# EAGLE design lmzmv0 (EAGLE 9.6.2)
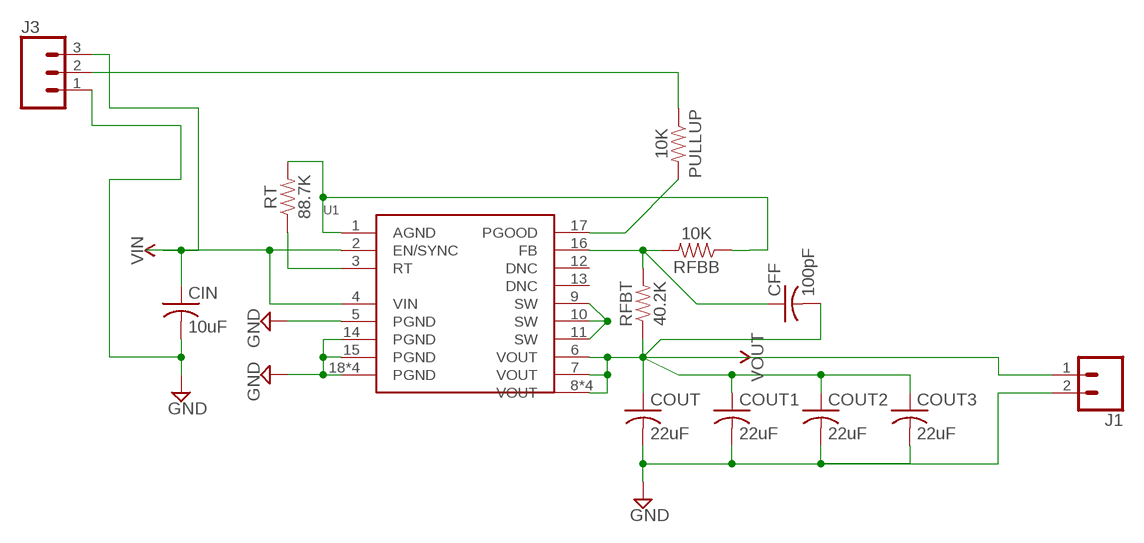
[diagram p0: schematic, sheet 1]

## Parts
CFF  100pF  C-USC0603  [C0603]
CIN  10uF  C-USC0603  [C0603]
COUT  22uF  C-USC0603  [C0603]
COUT1  22uF  C-USC0603  [C0603]
COUT2  22uF  C-USC0603  [C0603]
COUT3  22uF  C-USC0603  [C0603]
J1  CONN_02  [1X02]
J3  CONN_031X03_NO_SILK  [1X03_NO_SILK]
PULLUP  10K  RESISTOR0603  [0603]
RFBB  10K  RESISTOR0603  [0603]
RFBT  40.2K  RESISTOR0603  [0603]
RT  88.7K  RESISTOR0603  [0603]
U1  LMZM_MODULEQFN18TI  [QFN-18]

## Nets
AGND: RFBB.1 RT.2 U1.1(AGND)
FB: CFF.1 RFBB.2 RFBT.2 U1.16(FB)
GND: CIN.2 COUT1.2 COUT2.2 COUT3.2 COUT.2 J1.2 J3.1 U1.5(PGND) U1.14(PGND) U1.15(PGND) U1.18(PGND) U1.W1(PGND) U1.W2(PGND) U1.W(PGND)
PGOOD: PULLUP.2 U1.17(PGOOD)
RT: RT.1 U1.3(RT)
SW: U1.9(SW) U1.10(SW) U1.11(SW)
TPGOOD: J3.2 PULLUP.1
VIN: CIN.1 J3.3 U1.2(EN/SYNC) U1.4(VIN)
VOUT: CFF.2 COUT1.1 COUT2.1 COUT3.1 COUT.1 J1.1 RFBT.1 U1.6(VOUT) U1.7(VOUT) U1.8(VOUT) U1.X1(VOUT) U1.X2(VOUT) U1.X(VOUT)
Unconnected: U1.12(DNC) U1.13(DNC)

## Library data of the parts
CFF = adafruit:C-US: CAPACITOR, American symbol; MF: YAGEO; MPN: CC0603JRNPO9BN101; OC_NEWARK: 68R4713
CIN = adafruit:C-US: CAPACITOR, American symbol; MF: TAIYO YUDEN; MPN: LMK107BJ106MALTD; OC_NEWARK: 84R9134
COUT COUT1-COUT3 = adafruit:C-US: CAPACITOR, American symbol; MF: AVX; MPN: F980G226MMA; OC_NEWARK: 84R8910
J1 = SparkFun-Connectors:CONN_02: Multi connection point. Often used as Generic Header-pin footprint for 0.1 inch spaced/style header connections On any of the 0.1 inch spaced packages, you can populate with these: Break Away Headers - Straight <https://www.sparkfun.com/products/116> (PRT-00116) Break Away Male Headers - Right Angle <https://www.sparkfun.com/products/553> (PRT-00553) Female Headers <https://www.sparkfun.com/products/115> (PRT-00115) Break Away Headers - Machine Pin <https://www.sparkfun.com/products/117> (PRT-00117) Break Away Female Headers - Swiss Machine Pin <https://www.sparkfun.com/products/743> (PRT-00743) For SCREWTERMINALS and SPRING TERMINALS visit here: Screw Terimnals on SparkFun.com <https://www.sparkfun.com/search/results?term=Screw+Terminals> (5mm/3.5mm/2.54mm spacing) This device is also useful as a general connection point to wire up your design to another part of your project. Our various solder wires solder well into these plated through hole pads. Hook-Up Wire - Assortment (Stranded, 22 AWG) <https://www.sparkfun.com/products/11375> (PRT-11375) Hook-Up Wire - Assortment (Solid Core, 22 AWG) <https://www.sparkfun.com/products/11367> (PRT-11367) View the entire wire category on our website here <https://www.sparkfun.com/categories/141> Special notes: Molex polarized connector foot print use with: PRT-08233 with associated crimp pins and housings. 2.54_SCREWTERM for use with PRT-10571. 3.5mm Screw Terminal footprints for PRT-08084 5mm Screw Terminal footprints for use with PRT-08432; OC_NEWARK: unknown
J3 = SparkFun-Connectors:CONN_03: Multi connection point. Often used as Generic Header-pin footprint for 0.1 inch spaced/style header connections On any of the 0.1 inch spaced packages, you can populate with these: Break Away Headers - Straight <https://www.sparkfun.com/products/116> (PRT-00116) Break Away Male Headers - Right Angle <https://www.sparkfun.com/products/553> (PRT-00553) Female Headers <https://www.sparkfun.com/products/115> (PRT-00115) Break Away Headers - Machine Pin <https://www.sparkfun.com/products/117> (PRT-00117) Break Away Female Headers - Swiss Machine Pin <https://www.sparkfun.com/products/743> (PRT-00743) Stackable Header - 3 Pin (Female, 0.1") <https://www.sparkfun.com/products/13875> (PRT-13875) For SCREWTERMINALS and SPRING TERMINALS visit here: Screw Terimnals on SparkFun.com <https://www.sparkfun.com/search/results?term=Screw+Terminals> (5mm/3.5mm/2.54mm spacing) This device is also useful as a general connection point to wire up your design to another part of your project. Our various solder wires solder well into these plated through hole pads. Hook-Up Wire - Assortment (Stranded, 22 AWG) <https://www.sparkfun.com/products/11375> (PRT-11375) Hook-Up Wire - Assortment (Solid Core, 22 AWG) <https://www.sparkfun.com/products/11367> (PRT-11367) View the entire wire category on our website here <https://www.sparkfun.com/categories/141> Special notes: Molex polarized connector foot print use with SKU : PRT-08232 with associated crimp pins and housings.; OC_NEWARK: unknown
PULLUP RFBB = SparkFun-Resistors:RESISTOR: Generic Resistor Package; MF: YAGEO; MPN: RC0603FR-0710KL; OC_NEWARK: 68R0049
RFBT = SparkFun-Resistors:RESISTOR: Generic Resistor Package; MF: MULTICOMP PRO; MPN: MC0603SAF4022T5E; OC_NEWARK: 04P0417
RT = SparkFun-Resistors:RESISTOR: Generic Resistor Package; MF: PANASONIC; MPN: ERJ-S03D8872V; OC_NEWARK: 65AC7547
U1 = lmzm33603:LMZM_MODULE; MPN: LMZM33603RLRR; OC_NEWARK: unknown

## Board
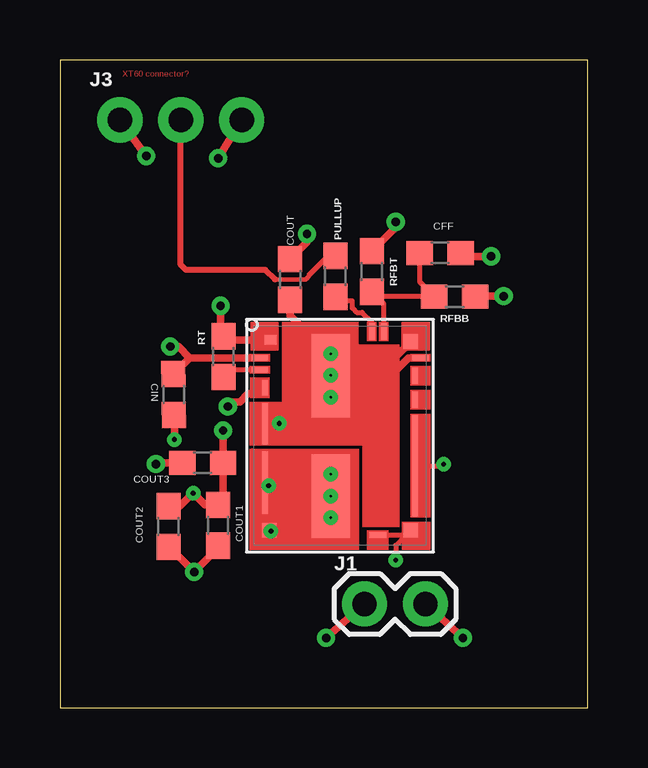
[diagram p1: board, top side]
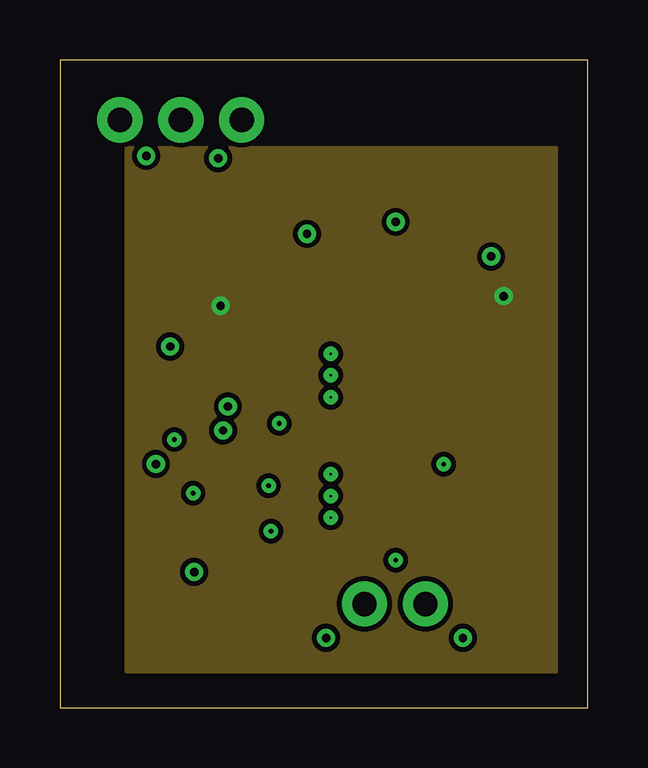
[diagram p2: board, inner layer Route2]
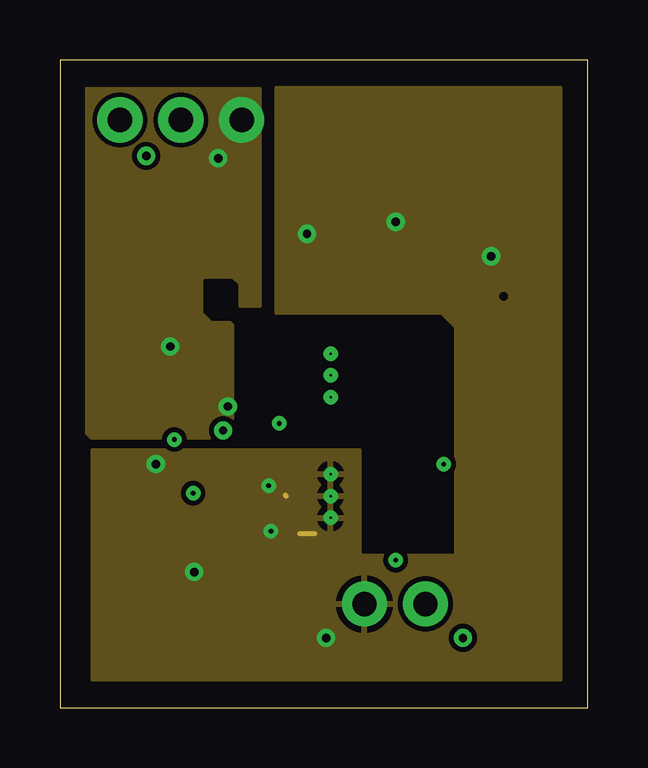
[diagram p3: board, inner layer Route15]
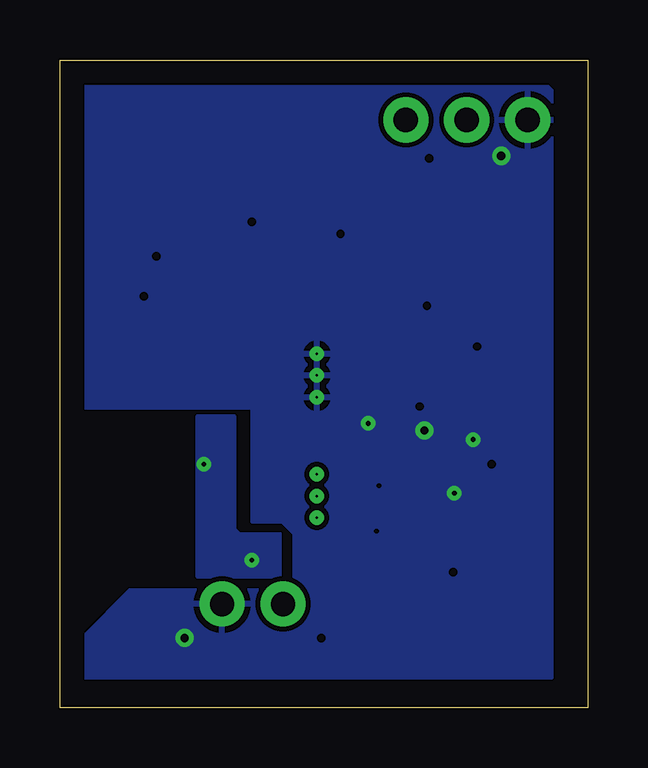
[diagram p4: board, bottom side, seen from below]

Size 22 x 27 mm. Coordinates in mm from the lower left corner, seen from the top.
Outline: 0,0 22,0 22,27 0,27 0,0
Copper layers [15:(1+2*15+16)]: Top 0.035mm / dielectric 1.5mm / Route2 0.035mm / dielectric 0.15mm / Route15 0.035mm / dielectric 0.2mm / Bottom 0.035mm
Design rules "default *": minimum track width 8mil, minimum drill 0.35mm, track to track 8mil, track to pad 8mil, pad to pad 6mil, via to via 6mil, smd to smd 6mil, copper to edge 40mil, drill to drill 6mil, minimum pad ring 10mil, minimum via ring 8mil, stop-mask expansion 4mil, vias tented up to drill 0mil, thermal gap 10mil

### Footprints (pad centres in the part's own frame; a part is rotated, then mirrored left to right if it is on the bottom)
C0603 = smd 1.1 x 1: 1 -0.85,0; 2 0.85,0
1X02 = drill 1.016 pad 1.88: 1 0,0; 2 2.54,0
1X03_NO_SILK = drill 1.016 pad 1.88: 1 0,0; 2 2.54,0; 3 5.08,0
0603 = smd 1.1 x 1: 1 -0.85,0; 2 0.85,0
QFN-18 = smd 0.5 x 0.4: 1 -2.9,4 | smd 0.7 x 0.25: 2 -3.35,3.25; 3 -3.35,2.75; 9 1.58,-4.127; 14 3.35,3.25 | smd 0.25 x 0.635: 4 -3.129,2 | smd 0.25 x 1.74: 5 -3.129,0.49 | smd 0.25 x 2.6: 6 -3.129,-1.95 | smd 0.595 x 0.62: 7 -2.947,-3.935; 10 2.947,-3.935; 15 2.947,3.935 | smd 1.6 x 3.48: 8 -0.395,-2.51; 18 -0.395,2.51 | smd 0.25 x 4.25: 11 3.129,-1.25 | smd 0.25 x 0.7: 12 3.129,1.5; 13 3.129,2.5; 16 1.83,4.35; 17 1.33,4.35 | drill 0.1 pad 0.2: W -0.395,3.42; W1 -0.395,2.52; W2 -0.395,1.6; X -0.395,-1.6; X1 -0.395,-2.51; X2 -0.395,-3.42

### Placement (x,y rotation side)
CFF  15.85,18.95 0 top
CIN  4.74,13.05 270.5 top
COUT  9.6,17.85 270 top
COUT1  6.6,7.6 90 top
COUT2  4.53,7.55 90 top
COUT3  5.95,10.2 0 top
J1  12.7,4.32 0 top
J3  2.5,24.5 0 top
PULLUP  11.48,17.98 270 top
RFBB  16.46,17.13 180 top
RFBT  13,18.18 270 top
RT  6.82,14.63 90 top
U1  11.68,11.33 0 top

### Tracks (layer width: path | path; a pad name or v marks a point on that pad's centre or on a via)
AGND  (via drill 0.35 layers 1-2)
  Top 0.152: RT.2 6.8,15.5
  Top 0.305: v6.7,16.75 6.7,15.5 6.72,15.48 RT.2 6.97,15.33 U1.1 | RFBB.1 17.33,17.15 v18.5,17.15
  pour Route2 (no thermals): 2.75,1.48 2.75,23.34 20.7,23.34 20.7,1.48
FB
  Top 0.203: CFF.1 15,17.74 RFBB.2 13,17.13 RFBT.2 13.49,16.84 13.49,15.7 U1.16
GND  (via drill 0.2, 0.35)
  Top 0.203: 4.78,12.27 4.75,12.3 | 9.12,11.82 v9.14,11.85
  Top 0.305: v6.8,11.55 COUT3.2 6.8,8.65 COUT1.2 | 6.55,8.4 COUT1.2 | COUT.2 9.6,16.35 11.3,14.65 | 11.3,14.65 11.29,14.63 U1.18 U1.W2 | U1.14 14.53,14.58 12.88,12.93 U1.W2 | U1.W2 | U1.15 14.63,15.24 14.04,14.65 11.3,14.65 | v4.78,11.18 4.78,12.27 4.75,12.25 CIN.2 | U1.5 9.12,11.82 | COUT2.2 5.02,8.4 v5.55,8.94 6.04,8.45 COUT1.2 | J1.2 v16.8,2.9 | v3.6,23 J3.1
  other vias: 15.24,4.32
  pour Bottom: 12.25,4.9 12.25,7.25 12.75,7.75 14,7.75 14,12.5 21,12.5 21,26 1.75,26 1.5,25.75 1.5,1.25 21,1.25 21,3 19.1,4.9
PGOOD
  Top 0.203: U1.17 13.01,16.07 12.6,16.48 12.37,16.48 12.2,16.65 12.2,16.95 11.65,16.95 PULLUP.2
RT
  Top 0.203: U1.3 7.12,14.08 RT.1
SW  (via drill 0.2)
  Top 0.203: U1.9 14.44,7.2 14,6.77 v14,6.15 | U1.11 15.93,10.08 v16,10.15
  Top 0.305: U1.10 14.44,7.2
  pour Bottom: 12.8,7.25 14.5,7.25 14.7,7.45 14.7,12.15 16.3,12.15 16.3,5.45 12.8,5.45
TPGOOD
  Top 0.203: PULLUP.1 11.18,18.83 10.4,18.05 10.4,18.02 10.27,17.87 8.97,17.85
  Top 0.254: 8.97,17.85 8.96,17.86 8.57,18.25 5.25,18.25 5.04,18.46 J3.2
VIN  (via drill 0.35 layers 1-15)
  Top 0.305: U1.2 5.41,14.58 | 5.41,14.58 CIN.1 | U1.4 8.32,13.1 7.85,13.1 7.5,12.75 7,12.75 v7,12.55 | 5.41,14.58 4.94,15.05 v4.6,15.05 | v6.6,22.9 J3.3
  pour Route15 (no thermals): 1.3,11.25 7.1,11.25 7.2,11.35 7.2,15.95 7.1,16.05 6.3,16.05 5.9,16.45 5.9,17.85 6,17.95 7.2,17.95 7.5,17.65 7.5,16.75 8.35,16.75 8.35,25.8 0.95,25.8 0.95,11.6
VOUT  (via drill 0.2 layers 1-15, 0.35 layers 1-15)
  Top 0.203: U1.6 8.68,9.25 v8.7,9.25 | U1.7 8.78,7.35 v8.8,7.35
  Top 0.305: 11.29,8.72 U1.X1 | COUT.1 10.3,19.4 v10.3,19.75 | v17.98,18.81 16.84,18.81 CFF.2 | RFBT.1 14,20.03 v14,20.25 | COUT3.1 4.05,10.2 v4,10.15 | COUT2.1 4.55,6.7 v5.6,5.65 6.6,6.65 COUT1.1 | v11.1,2.9 J1.1
  Route15 0.203: 10.62,7.25 10,7.25 | 9.43,8.82 9.4,8.85
  pour Route15: 1.35,10.75 1.35,1.15 20.89,1.15 20.89,25.85 9,25.85 9,16.45 15.9,16.45 16.5,15.85 16.5,6.35 12.5,6.35 12.5,10.75

### Text on the board
Top: XT60 connector?